# EAGLE design myc2000 (EAGLE 6.6.0)
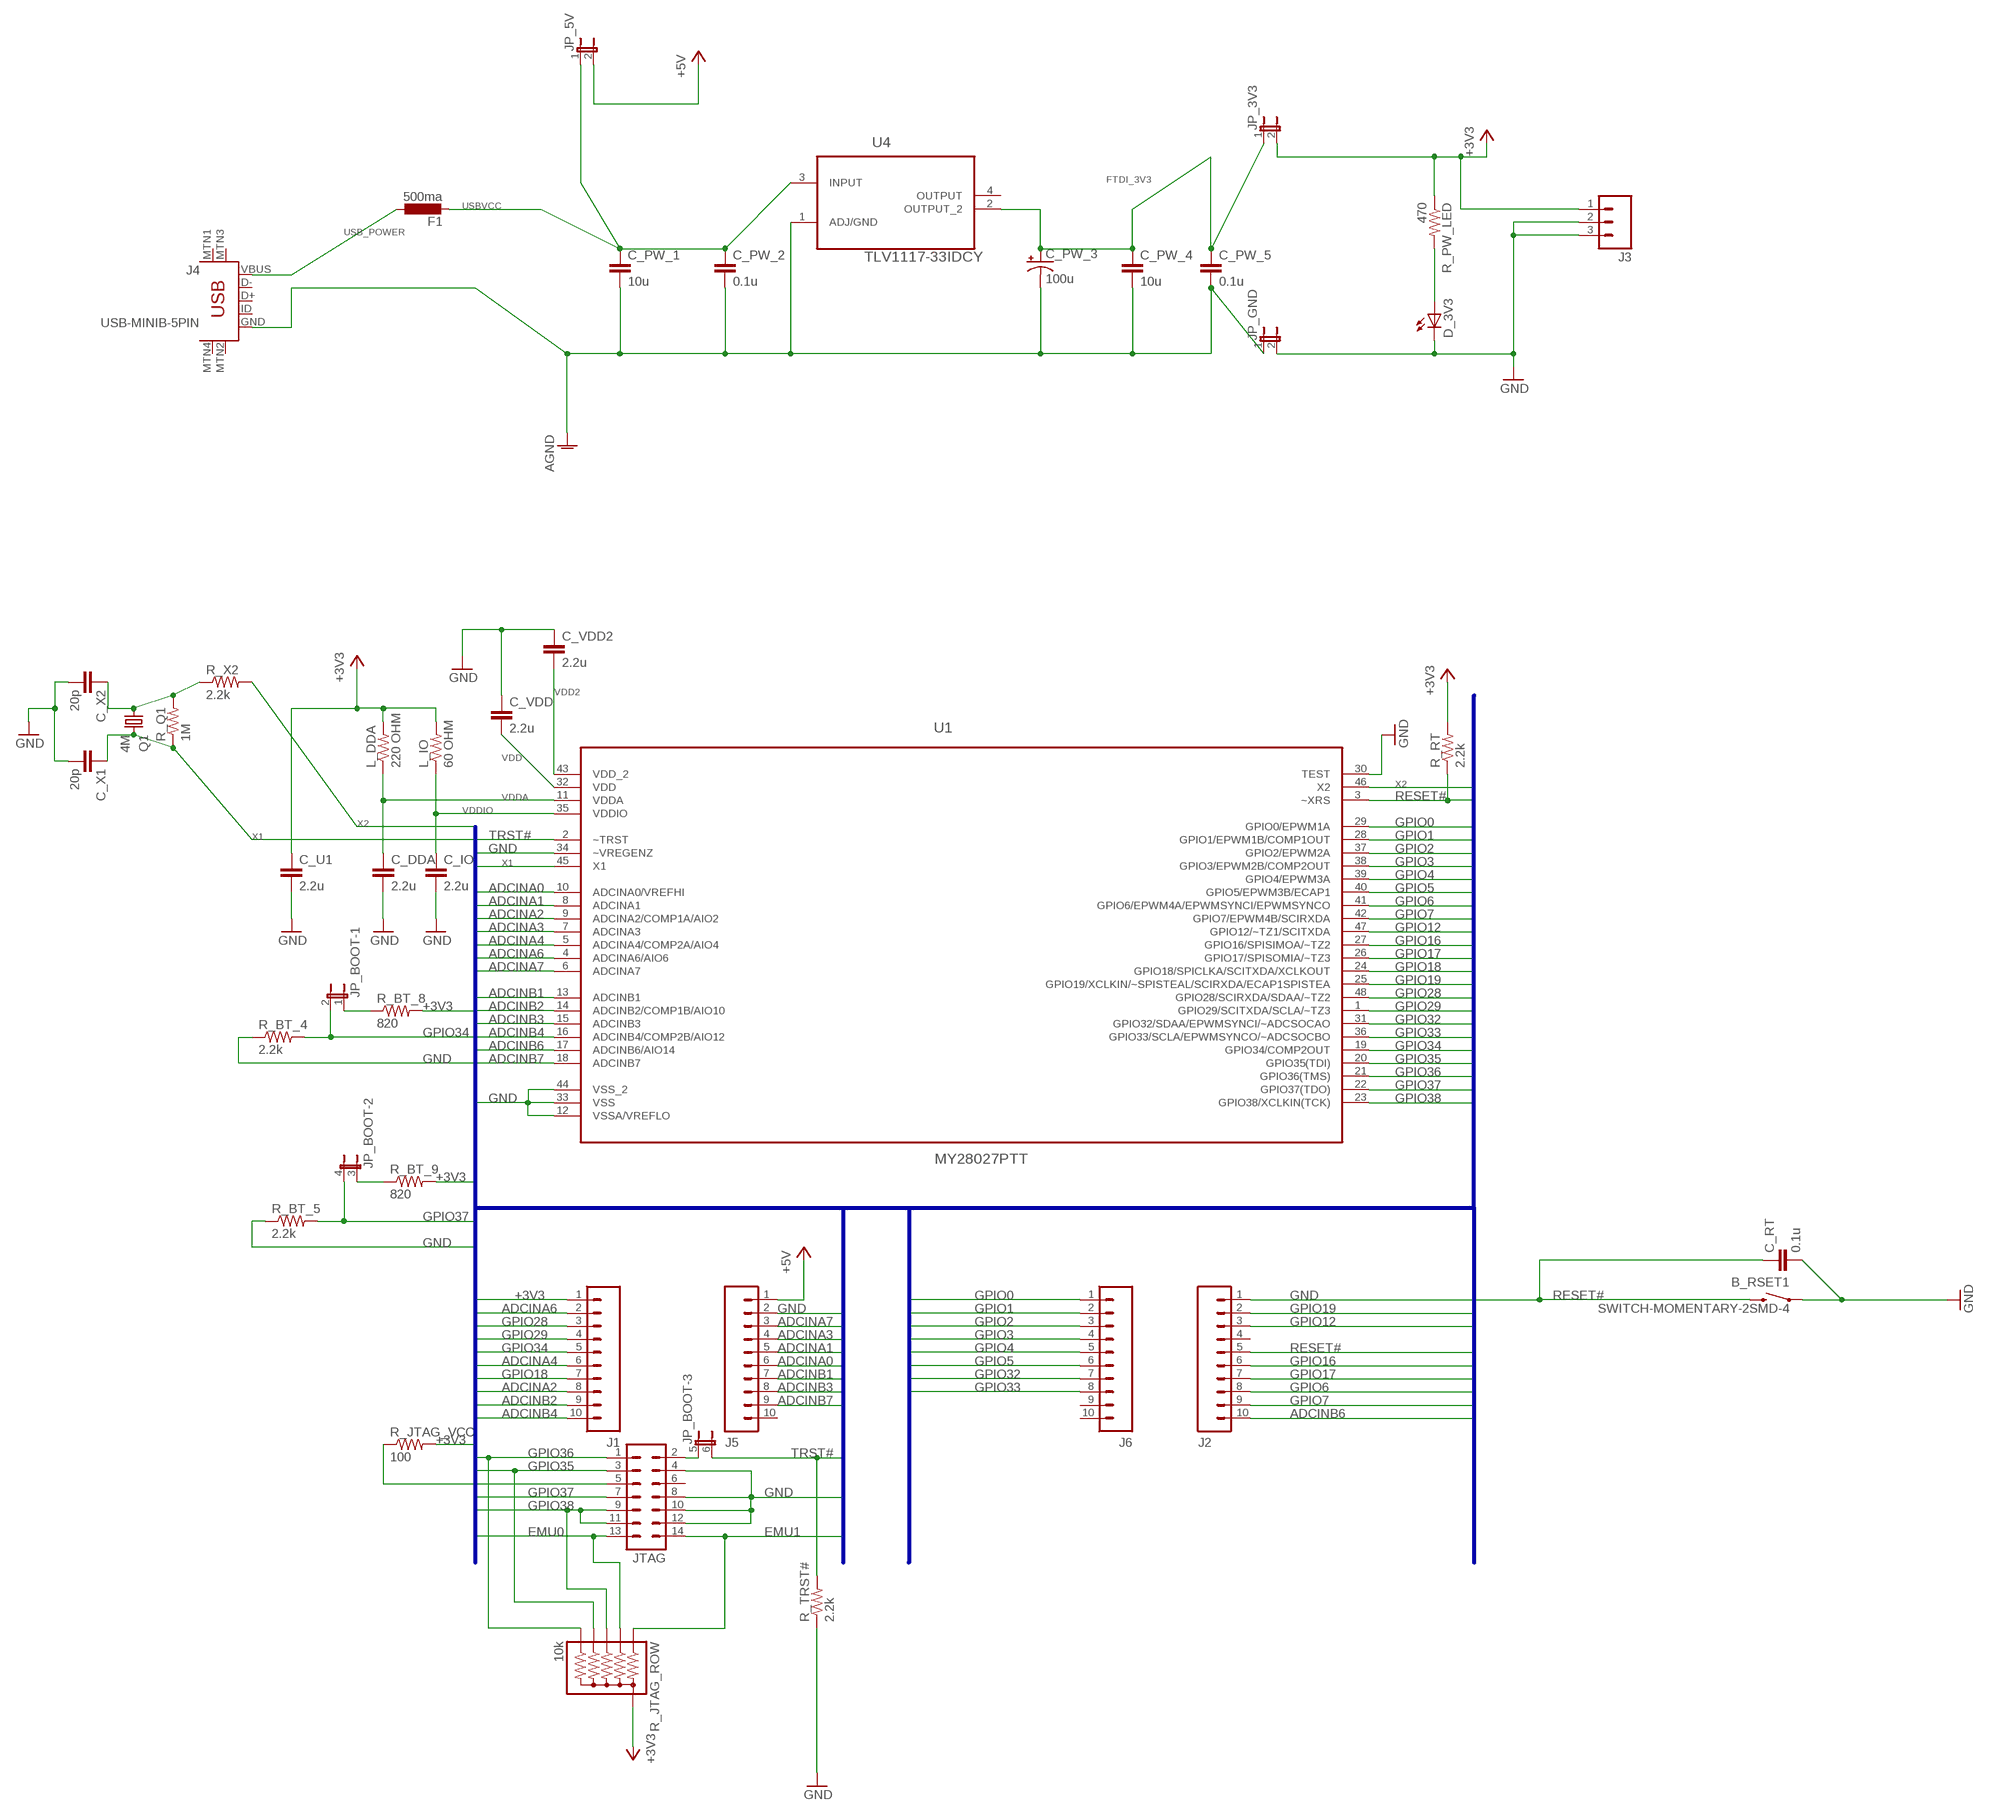
[diagram p0: schematic, sheet 1]

## Parts
B_RSET1  SWITCH-MOMENTARY-2SMD-4  [TACTILE_SWITCH_TALL]
C_DDA  2.2u  CAP0805  [0805]
C_IO  2.2u  CAP0805  [0805]
C_PW_1  10u  CAP0805  [0805]
C_PW_2  0.1u  CAP0805  [0805]
C_PW_3  100u  CAP_POL3528  [EIA3528]
C_PW_4  10u  CAP0805  [0805]
C_PW_5  0.1u  CAP0805  [0805]
C_RT  0.1u  CAP0805  [0805]
C_U1  2.2u  CAP0805  [0805]
C_VDD  2.2u  CAP0805  [0805]
C_VDD2  2.2u  CAP0805  [0805]
C_X1  20p  CAP0603-CAP  [0603-CAP]
C_X2  20p  CAP0603-CAP  [0603-CAP]
D_3V3  LEDSML0805  [SML0805]
F1  500ma  L-EUL1812  [L1812]
J1  M10NO_SILK_PTH_FEMALE  [1X10_NO_SILK]
J2  M10NO_SILK_PTH_FEMALE  [1X10_NO_SILK]
J3  M031X03_NO_SILK  [1X03_NO_SILK]
J4  USB-MINIB-5PIN  [USB-MINIB]
J5  M10NO_SILK_PTH_FEMALE  [1X10_NO_SILK]
J6  M10NO_SILK_PTH_FEMALE  [1X10_NO_SILK]
JP_3V3  JP1E  [JP1]
JP_5V  JP1E  [JP1]
JP_BOOT  JP3QE  [JP3Q]
JP_GND  JP1E  [JP1]
JTAG  MA07-2  [MA07-2]
L_DDA  220 OHM  RESISTOR0603  [0603-RES]
L_IO  60 OHM  RESISTOR0805-RES  [0805]
Q1  4M  CRYSTALHC49UP  [HC49UP]
R_BT_4  2.2k  RESISTOR0805-RES  [0805]
R_BT_5  2.2k  RESISTOR0805-RES  [0805]
R_BT_8  820  RESISTOR0805-RES  [0805]
R_BT_9  820  RESISTOR0805-RES  [0805]
R_JTAG_ROW  10k  RPACK-BUSSED-5-SIP-PTH-5  [RPACK-SIP-PTH-5]
R_JTAG_VCC  100  RESISTOR0805-RES  [0805]
R_PW_LED  470  RESISTOR0805-RES  [0805]
R_Q1  1M  RESISTOR0603  [0603-RES]
R_RT  2.2k  RESISTOR0805-RES  [0805]
R_TRST#  2.2k  RESISTOR0805-RES  [0805]
R_X2  2.2k  RESISTOR0603  [0603-RES]
U1  MY28027PTT  [QFP50P900X900X160-48N]
U4  TLV1117-33IDCY  [SOT230P700X180-4N]

## Nets
+3V3 [POWER]: C_U1.1 J1.1 J3.1 JP_3V3.2 L_DDA.2 L_IO.2 R_BT_8.2 R_BT_9.2 R_JTAG_ROW.P$1 R_JTAG_VCC.2 R_PW_LED.1 R_RT.2
+5V [P5V]: J5.1 JP_5V.2
ADCINA0: J5.6 U1.10(ADCINA0/VREFHI)
ADCINA1: J5.5 U1.8(ADCINA1)
ADCINA2: J1.8 U1.9(ADCINA2/COMP1A/AIO2)
ADCINA3: J5.4 U1.7(ADCINA3)
ADCINA4: J1.6 U1.5(ADCINA4/COMP2A/AIO4)
ADCINA6: J1.2 U1.4(ADCINA6/AIO6)
ADCINA7: J5.3 U1.6(ADCINA7)
ADCINB1: J5.7 U1.13(ADCINB1)
ADCINB2: J1.9 U1.14(ADCINB2/COMP1B/AIO10)
ADCINB3: J5.8 U1.15(ADCINB3)
ADCINB4: J1.10 U1.16(ADCINB4/COMP2B/AIO12)
ADCINB6: J2.10 U1.17(ADCINB6/AIO14)
ADCINB7: J5.9 U1.18(ADCINB7)
AGND [P5V]: C_PW_1.2 C_PW_2.2 C_PW_3.C(-) C_PW_4.2 C_PW_5.2 J4.GND JP_GND.1 U4.1(ADJ/GND)
EMU0: JTAG.13 R_JTAG_ROW.P$3
EMU1: JTAG.14 R_JTAG_ROW.P$2
FTDI_3V3 [P5V]: C_PW_3.A(+) C_PW_4.1 C_PW_5.1 JP_3V3.1 U4.2(OUTPUT_2)
GND [POWER]: B_RSET1.A2 C_DDA.2 C_IO.2 C_RT.2 C_U1.2 C_VDD2.1 C_VDD.1 C_X1.2 C_X2.2 D_3V3.C J2.1 J3.2 J3.3 J5.2 JP_GND.2 JTAG.4 JTAG.8 JTAG.10 JTAG.12 R_BT_4.1 R_BT_5.1 R_TRST#.1 U1.12(VSSA/VREFLO) U1.30(TEST) U1.33(VSS) U1.34(~VREGENZ) U1.44(VSS_2)
GPIO0: J6.1 U1.29(GPIO0/EPWM1A)
GPIO1: J6.2 U1.28(GPIO1/EPWM1B/COMP1OUT)
GPIO2: J6.3 U1.37(GPIO2/EPWM2A)
GPIO3: J6.4 U1.38(GPIO3/EPWM2B/COMP2OUT)
GPIO4: J6.5 U1.39(GPIO4/EPWM3A)
GPIO5: J6.6 U1.40(GPIO5/EPWM3B/ECAP1)
GPIO6: J2.8 U1.41(GPIO6/EPWM4A/EPWMSYNCI/EPWMSYNCO)
GPIO7: J2.9 U1.42(GPIO7/EPWM4B/SCIRXDA)
GPIO12: J2.3 U1.47(GPIO12/~TZ1/SCITXDA)
GPIO16: J2.6 U1.27(GPIO16/SPISIMOA/~TZ2)
GPIO17: J2.7 U1.26(GPIO17/SPISOMIA/~TZ3)
GPIO18: J1.7 U1.24(GPIO18/SPICLKA/SCITXDA/XCLKOUT)
GPIO19: J2.2 U1.25(GPIO19/XCLKIN/~SPISTEAL/SCIRXDA/ECAP1SPISTEA)
GPIO28 [SCI]: J1.3 U1.48(GPIO28/SCIRXDA/SDAA/~TZ2)
GPIO29 [SCI]: J1.4 U1.1(GPIO29/SCITXDA/SCLA/~TZ3)
GPIO32: J6.7 U1.31(GPIO32/SDAA/EPWMSYNCI/~ADCSOCAO)
GPIO33: J6.8 U1.36(GPIO33/SCLA/EPWMSYNCO/~ADCSOCBO)
GPIO34: J1.5 JP_BOOT.2 R_BT_4.2 U1.19(GPIO34/COMP2OUT)
GPIO35 [JTAG]: JTAG.3 R_JTAG_ROW.P$5 U1.20(GPIO35(TDI))
GPIO36 [JTAG]: JTAG.1 R_JTAG_ROW.P$6 U1.21(GPIO36(TMS))
GPIO37 [JTAG]: JP_BOOT.4 JTAG.7 R_BT_5.2 U1.22(GPIO37(TDO))
GPIO38 [JTAG]: JTAG.9 JTAG.11 R_JTAG_ROW.P$4 U1.23(GPIO38/XCLKIN(TCK))
JTAG_TRST: JP_BOOT.5 JTAG.2
N$1: D_3V3.A R_PW_LED.2
N$11: JP_BOOT.3 R_BT_9.1
N$12: JP_BOOT.1 R_BT_8.1
N$13: JTAG.5 R_JTAG_VCC.1
RESET# [CLOCK]: B_RSET1.B2 C_RT.1 J2.5 R_RT.1 U1.3(~XRS)
TRST#: JP_BOOT.6 R_TRST#.2 U1.2(~TRST)
USB_POWER [P5V]: F1.1 J4.VBUS
USBVCC [P5V]: C_PW_1.1 C_PW_2.1 F1.2 JP_5V.1 U4.3(INPUT)
VDD [P4CORE]: C_VDD.2 U1.32(VDD)
VDD2 [P4CORE]: C_VDD2.2 U1.43(VDD_2)
VDDA [POWER]: C_DDA.1 L_DDA.1 U1.11(VDDA)
VDDIO [POWER]: C_IO.1 L_IO.1 U1.35(VDDIO)
X1 [CLOCK]: C_X1.1 Q1.2 R_Q1.1 U1.45(X1)
X2 [CLOCK]: R_X2.2 U1.46(X2)
X2_2 [CLOCK]: C_X2.1 Q1.1 R_Q1.2 R_X2.1
Unconnected: J2.4 J4.D+ J4.D- J4.ID J4.MTN1(MTN2) J4.MTN2(MTN3) J4.MTN3(MTN1) J4.MTN4 J5.10 J6.9 J6.10 JTAG.6 U4.4(OUTPUT)

## Buses
GPIO[0..38],ADCINA[0..7],ADCINB[0..7],GND,TRST#,RESET#,+3V3,EMU0,EMU1,X1,X2

## Library data of the parts
B_RSET1 = SparkFun-Electromechanical:SWITCH-MOMENTARY-2: Various NO switches- pushbuttons, reed, etc; PROD_ID: SWCH-11966
C_DDA C_IO C_PW_1 C_PW_2 C_PW_4 C_PW_5 C_RT C_U1 C_VDD C_VDD2 C_X1 C_X2 = SparkFun-Capacitors:CAP: Capacitor Standard 0603 ceramic capacitor, and 0.1" leaded capacitor.
C_PW_3 = SparkFun-Capacitors:CAP_POL: Capacitor Polarized These are standard SMD and PTH capacitors. Normally 10uF, 47uF, and 100uF in electrolytic and tantalum varieties. Always verify the external diameter of the through hole cap, it varies with capacity, voltage, and manufacturer. The EIA devices should be standard.
D_3V3 = led:LED: LED OSRAM: - CHIPLED LG R971, LG N971, LY N971, LG Q971, LY Q971, LO R971, LY R971 LH N974, LH R974 LS Q976, LO Q976, LY Q976 LO Q996 - Hyper CHIPLED LW Q18S LB Q993, LB Q99A, LB R99A - SideLED LS A670, LO A670, LY A670, LG A670, LP A670 LB A673, LV A673, LT A673, LW A673 LH A674 LY A675 LS A676, LA A676, LO A676, LY A676, LW A676 LS A679, LY A679, LG A679 - Hyper Micro SIDELED® LS Y876, LA Y876, LO Y876, LY Y876 LT Y87S - SmartLED LW L88C, LW L88S LB L89C, LB L89S, LG L890 LS L89K, LO L89K, LY L89K LS L896, LA L896, LO L896, LY L896 - TOPLED LS T670, LO T670, LY T670, LG T670, LP T670 LSG T670, LSP T670, LSY T670, LOP T670, LYG T670 LG T671, LOG T671, LSG T671 LB T673, LV T673, LT T673, LW T673 LH T674 LS T676, LA T676, LO T676, LY T676, LB T676, LH T676, LSB T676, LW T676 LB T67C, LV T67C, LT T67C, LS T67K, LO T67K, LY T67K, LW E67C LS E67B, LA E67B, LO E67B, LY E67B, LB E67C, LV E67C, LT E67C LW T67C LS T679, LY T679, LG T679 LS T770, LO T770, LY T770, LG T770, LP T770 LB T773, LV T773, LT T773, LW T773 LH T774 LS E675, LA E675, LY E675, LS T675 LS T776, LA T776, LO T776, LY T776, LB T776 LHGB T686 LT T68C, LB T68C - Hyper Mini TOPLED® LB M676 - Mini TOPLED Santana® LG M470 LS M47K, LO M47K, LY M47K Source: http://www.osram.convergy.de LUXEON: - LUMILED® LXK2-PW12-R00, LXK2-PW12-S00, LXK2-PW14-U00, LXK2-PW14-V00 LXK2-PM12-R00, LXK2-PM12-S00, LXK2-PM14-U00 LXK2-PE12-Q00, LXK2-PE12-R00, LXK2-PE12-S00, LXK2-PE14-T00, LXK2-PE14-U00 LXK2-PB12-K00, LXK2-PB12-L00, LXK2-PB12-M00, LXK2-PB14-N00, LXK2-PB14-P00, LXK2-PB14-Q00 LXK2-PR12-L00, LXK2-PR12-M00, LXK2-PR14-Q00, LXK2-PR14-R00 LXK2-PD12-Q00, LXK2-PD12-R00, LXK2-PD12-S00 LXK2-PH12-R00, LXK2-PH12-S00 LXK2-PL12-P00, LXK2-PL12-Q00, LXK2-PL12-R00 Source: www.luxeon.com KINGBRIGHT: KA-3528ASYC Source: www.kingbright.com
F1 = rcl:L-EU: INDUCTOR, European symbol
J1 J2 J5 J6 = SparkFun-Connectors:M10: Header 10 Standard 10-pin 0.1" header. Use with straight break away headers (SKU : PRT-00116), right angle break away headers (PRT-00553), swiss pins (PRT-00743), machine pins (PRT-00117), and female headers (PRT-00115).; PROD_ID: CONN-11563
J3 = SparkFun-Connectors:M03: Header 3 Standard 3-pin 0.1" header. Use with straight break away headers (SKU : PRT-00116), right angle break away headers (PRT-00553), swiss pins (PRT-00743), machine pins (PRT-00117), and female headers (PRT-00115). Molex polarized connector foot print use with SKU : PRT-08232 with associated crimp pins and housings.
J4 = SparkFun-Connectors:USB-MINIB: Mini-USB "B" connector with 5th pin broken out. Created new symbol breaking out 5th "ID" pin in mini/micro USB connector spec. See: http://en.wikipedia.org/wiki/Mini_usb#Cables. Uses same footprint as 4-pin symbol. Also added pins to connect to mounting / shield pads if required (probably not generally needed as signals aren't shielded once they leave the connector).; PROD_ID: CONN-08193
JP_3V3 JP_5V JP_GND = jumper:JP1E: JUMPER
JP_BOOT = jumper:JP3QE: JUMPER
JTAG = con-lstb:MA07-2: PIN HEADER; OC_FARNELL: unknown; OC_NEWARK: unknown
L_DDA L_IO R_BT_4 R_BT_5 R_BT_8 R_BT_9 R_JTAG_VCC R_PW_LED R_Q1 R_RT R_TRST# R_X2 = SparkFun-Resistors:RESISTOR: Resistor Basic schematic elements and footprints for 0603, 1206, and PTH resistors.
Q1 = crystal:CRYSTAL: CRYSTAL; OC_FARNELL: unknown; OC_NEWARK: unknown
R_JTAG_ROW = SparkFun-Resistors:RPACK-BUSSED-5: BOURNS 4600X series thick-film SIP resistor packs Five resistors bussed to a single pin (denoted by dot). 0.2W / resistor datasheet <http://dlnmh9ip6v2uc.cloudfront.net/datasheets/Components/General/4600x.pdf> SFE parts COM-10855 (330), COM-10856 (10K)
U1 = Texas Instruments_By_element14_Batch_1:MY28027PTT
U4 = Texas Instruments_By_element14_Batch_1:TLV1117-33IDCY: V REG, LDO, 3.3V, 0.8A; MPN: TLV1117-33IDCY; OC_FARNELL: 1703385; OC_NEWARK: 67K8522; PACKAGE: SOT-223-3; SUPPLIER: TEXAS INSTRUMENTS

## Net classes
0 default: width 0.127 mm, drill 0.127 mm, clearance 0.127 mm
1 POWER: width 0.254 mm, drill 0.127 mm, clearance 0.127 mm to class 0, clearance 0.127 mm
2 CLOCK: width 0.127 mm, drill 0.127 mm, clearance 0.127 mm to class 0, clearance 0.127 mm to class 1, clearance 0.127 mm
3 P4CORE: width 0.203 mm, drill 0.127 mm, clearance 0.127 mm to class 0, clearance 0.127 mm to class 1, clearance 0.127 mm to class 2, clearance 0.127 mm
4 P5V: width 0.508 mm, drill 0.127 mm, clearance 0.127 mm to class 0, clearance 0.127 mm to class 1, clearance 0.127 mm to class 2, clearance 0.127 mm to class 3, clearance 0.127 mm
5 JTAG: width 0.127 mm, drill 0.127 mm, clearance 0.127 mm to class 0, clearance 0.127 mm to class 1, clearance 0.127 mm to class 2, clearance 0.127 mm to class 3, clearance 0.127 mm to class 4, clearance 0.127 mm
6 SCI: width 0.127 mm, drill 0.127 mm, clearance 0.127 mm to class 0, clearance 0.127 mm to class 1, clearance 0.127 mm to class 2, clearance 0.127 mm to class 3, clearance 0.127 mm to class 4, clearance 0.127 mm to class 5, clearance 0.127 mm

## Board
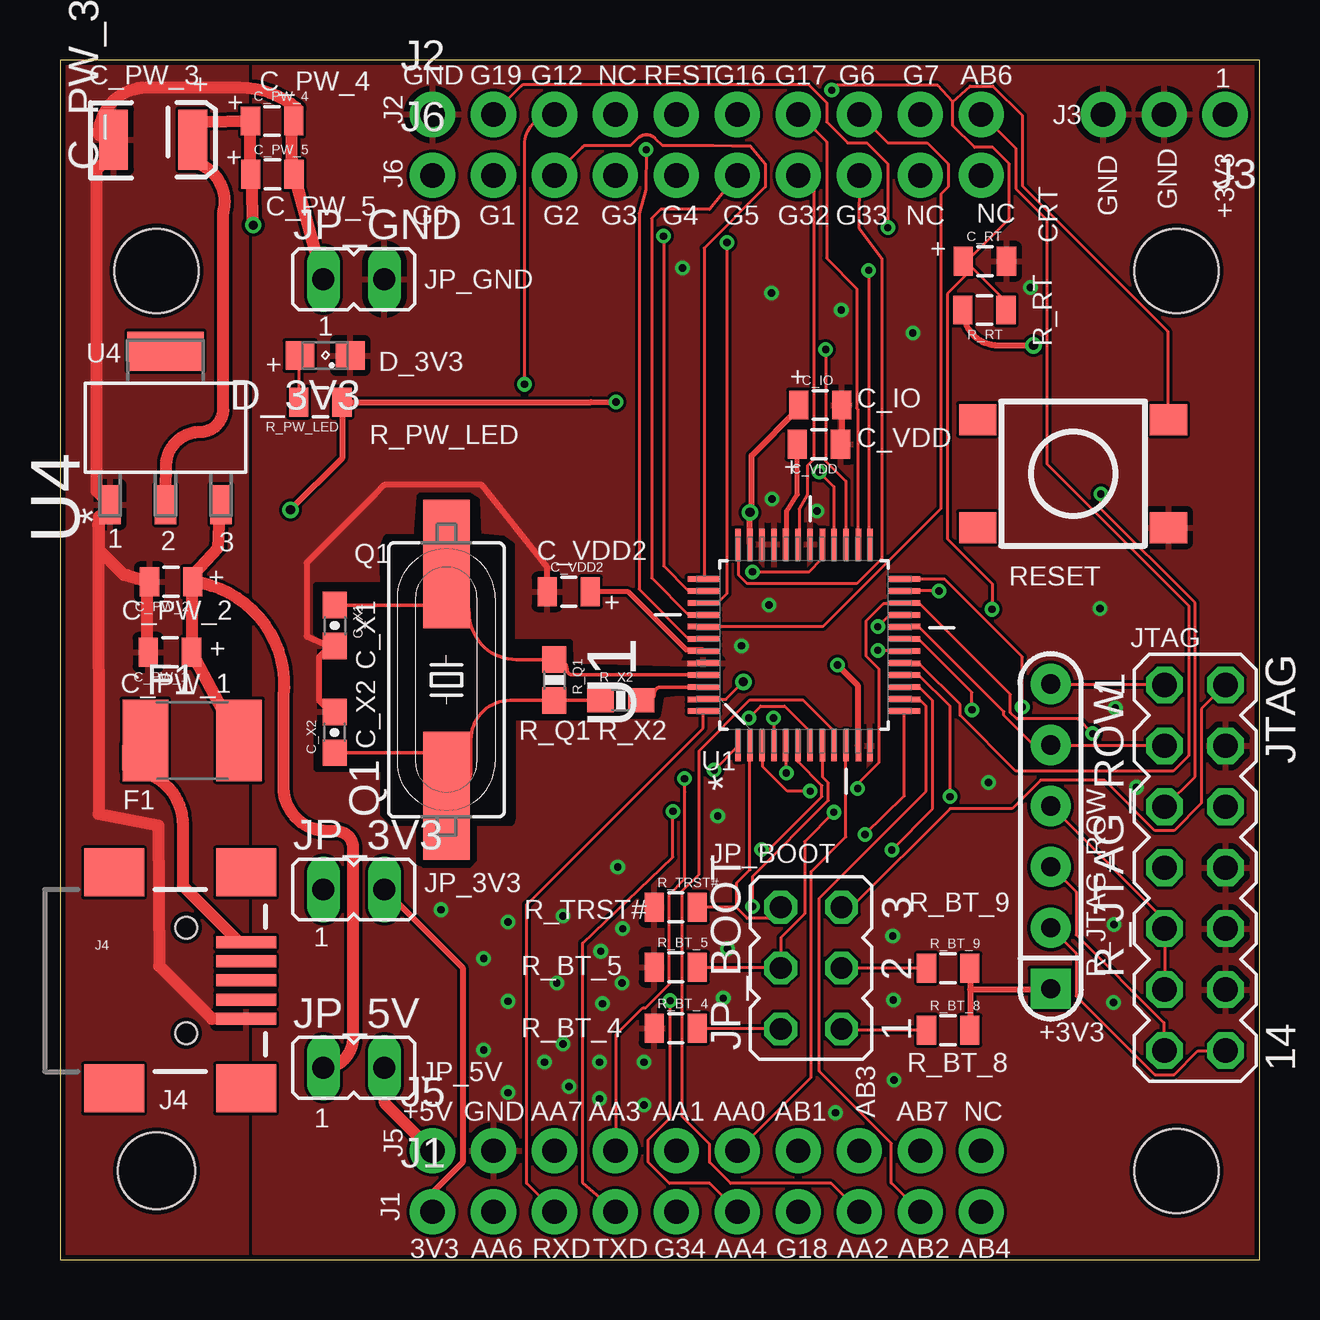
[diagram p1: board, top side]
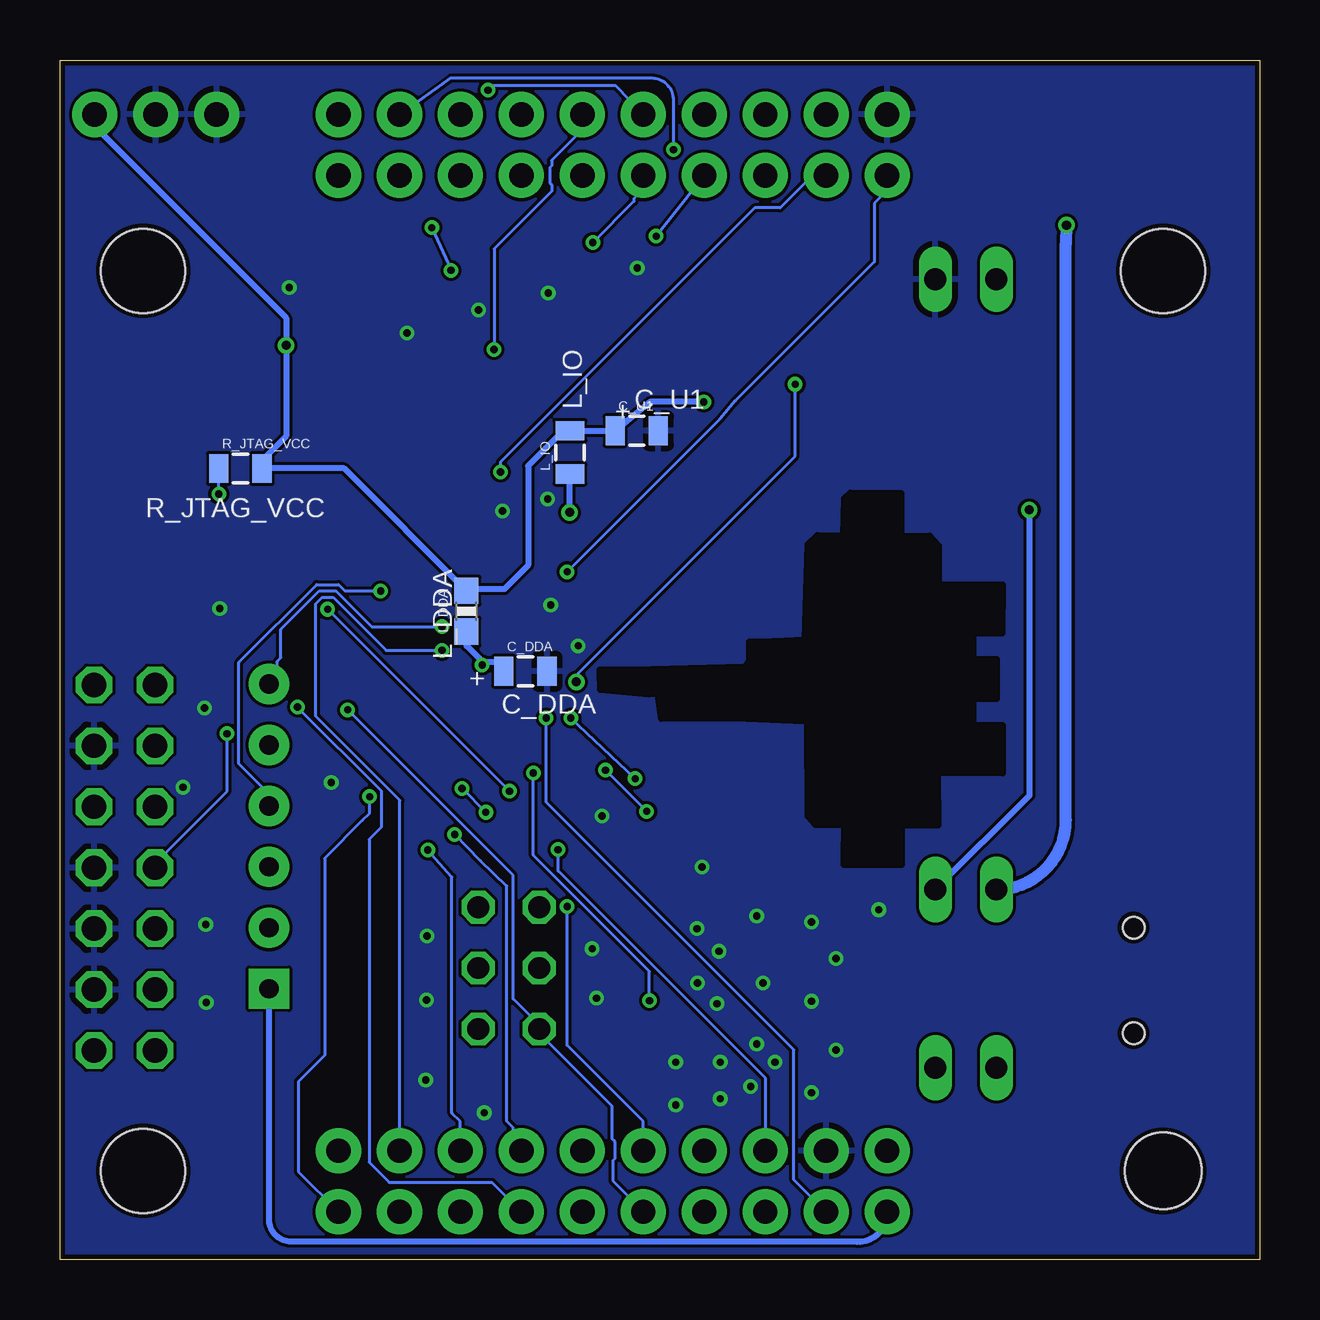
[diagram p2: board, bottom side, seen from below]

Size 49.99 x 49.99 mm. Coordinates in mm from the lower left corner, seen from the top.
Outline: 0,0 49.99,0 49.99,49.99 0,49.99 0,0
Copper layers (1*16): Top 0.035mm / dielectric 1.5mm / Bottom 0.035mm
Design rules "myc2000_drc": minimum track width 5mil, minimum drill 0.3mm, track to track 5mil, track to pad 6mil, pad to pad 6mil, via to via 5mil, smd to smd 6mil, copper to edge 8mil, drill to drill 6mil, minimum pad ring 6mil, minimum via ring 6mil, stop-mask expansion 4mil, vias tented up to drill 25mil, thermal gap 10mil
Holes 3.5 mm at 4.02,41.2 46.52,41.2 46.52,3.7
Holes 3.2 mm at 4.02,3.7
tRestrict: area 10.7,16.5 to 27.5,31.8
bRestrict: area 10.7,16.5 to 27.5,32

### Footprints (pad centres in the part's own frame; a part is rotated, then mirrored left to right if it is on the bottom)
TACTILE_SWITCH_TALL = smd 1.55 x 1.3: A1 -3.975,-2.25; A2 3.975,-2.25; B1 -3.975,2.25; B2 3.975,2.25
0805 = smd 0.8 x 1.2: 1 -0.9,0; 2 0.9,0
EIA3528 = smd 1.2 x 2.5: A 1.65,0; C -1.65,0
0603-CAP = smd 1.1 x 1: 1 -0.85,0; 2 0.85,0
SML0805 = smd 1.2 x 1.2: A 1.05,0; C -1.05,0
L1812 = smd 1.9 x 3.4: 1 -1.95,0; 2 1.95,0
1X10_NO_SILK = drill 1.016 pad 1.88: 1 0,0; 2 2.54,0; 3 5.08,0; 4 7.62,0; 5 10.16,0; 6 12.7,0; 7 15.24,0; 8 17.78,0; 9 20.32,0; 10 22.86,0
1X03_NO_SILK = drill 1.016 pad 1.88: 1 0,0; 2 2.54,0; 3 5.08,0
USB-MINIB = smd 2.5 x 0.5: D+ 2.5,0; D- 2.5,0.8; GND 2.5,-1.6; ID 2.5,-0.8; VBUS 2.5,1.6 | smd 2.5 x 2: MTN1 -3,4.5; MTN2 2.5,4.5; MTN3 -3,-4.5; MTN4 2.5,-4.5 | hole 0.9: 0,2.2; 0,-2.2
JP1 = drill 0.914 long: 1 0,-1.27; 2 0,1.27
JP3Q = drill 0.914 octagon: 1 -2.54,-1.27; 2 -2.54,1.27; 3 0,-1.27; 4 0,1.27; 5 2.54,-1.27; 6 2.54,1.27
MA07-2 = drill 1.016 octagon: 1 -7.62,-1.27; 2 -7.62,1.27; 3 -5.08,-1.27; 4 -5.08,1.27; 5 -2.54,-1.27; 6 -2.54,1.27; 7 0,-1.27; 8 0,1.27; 9 2.54,-1.27; 10 2.54,1.27; 11 5.08,-1.27; 12 5.08,1.27; 13 7.62,-1.27; 14 7.62,1.27
0603-RES = smd 1.1 x 1: 1 -0.85,0; 2 0.85,0
HC49UP = smd 5.334 x 1.93: 1 -4.826,0; 2 4.826,0
RPACK-SIP-PTH-5 = drill 0.8 pad 1.676 square: P$1 0,0 | drill 0.8 pad 1.676: P$2 0,-2.54; P$3 0,-5.08; P$4 0,-7.62; P$5 0,-10.16; P$6 0,-12.7
QFP50P900X900X160-48N = smd 1.321 x 0.229: 1 -4.191,2.743; 2 -4.191,2.261; 3 -4.191,1.753; 4 -4.191,1.245; 5 -4.191,0.762; 6 -4.191,0.254; 7 -4.191,-0.254; 8 -4.191,-0.762; 9 -4.191,-1.245; 10 -4.191,-1.753; 11 -4.191,-2.261; 12 -4.191,-2.743; 25 4.191,-2.743; 26 4.191,-2.261; 27 4.191,-1.753; 28 4.191,-1.245; 29 4.191,-0.762; 30 4.191,-0.254; 31 4.191,0.254; 32 4.191,0.762; 33 4.191,1.245; 34 4.191,1.753; 35 4.191,2.261; 36 4.191,2.743 | smd 0.229 x 1.321: 13 -2.743,-4.191; 14 -2.261,-4.191; 15 -1.753,-4.191; 16 -1.245,-4.191; 17 -0.762,-4.191; 18 -0.254,-4.191; 19 0.254,-4.191; 20 0.762,-4.191; 21 1.245,-4.191; 22 1.753,-4.191; 23 2.261,-4.191; 24 2.743,-4.191; 37 2.743,4.191; 38 2.261,4.191; 39 1.753,4.191; 40 1.245,4.191; 41 0.762,4.191; 42 0.254,4.191; 43 -0.254,4.191; 44 -0.762,4.191; 45 -1.245,4.191; 46 -1.753,4.191; 47 -2.261,4.191; 48 -2.743,4.191
SOT230P700X180-4N = smd 1.626 x 0.889: 1 -3.2,2.311; 2 -3.2,0; 3 -3.2,-2.311 | smd 1.626 x 3.175: 4 3.2,0

### Placement (x,y rotation side)
B_RSET1  42.21,32.75 0 top
C_DDA  30.6,24.52 0 bottom
C_IO  31.68,35.61 0 top
C_PW_1  4.58,25.31 180 top
C_PW_2  4.63,28.24 180 top
C_PW_3  3.88,46.67 0 top
C_PW_4  8.83,47.45 0 top
C_PW_5  8.85,45.22 0 top
C_RT  38.54,41.61 0 top
C_U1  25.96,34.54 0 bottom
C_VDD  31.62,33.98 180 top
C_VDD2  21.2,27.83 0 top
C_X1  11.45,26.42 270 top
C_X2  11.44,21.97 90 top
D_3V3  11.05,37.67 180 top
F1  5.51,21.64 0 top
J1  15.52,2 0 top
J2  15.52,47.72 0 top
J3  48.54,47.72 180 top
J4  5.26,11.63 0 top
J5  15.52,4.54 0 top
J6  15.52,45.18 0 top
JP_3V3  12.24,15.43 270 top
JP_5V  12.24,8 270 top
JP_BOOT  31.29,12.15 90 top
JP_GND  12.24,40.85 270 top
JTAG  47.29,16.33 270 top
L_DDA  33.05,27.02 90 bottom
L_IO  28.74,33.64 90 bottom
Q1  16.1,24.16 90 top
R_BT_4  25.66,9.64 0 top
R_BT_5  25.66,12.19 0 top
R_BT_8  37.01,9.56 0 top
R_BT_9  37.01,12.15 0 top
R_JTAG_ROW  41.28,11.29 180 top
R_JTAG_VCC  42.47,32.97 0 bottom
R_PW_LED  10.85,35.73 180 top
R_Q1  20.6,24.15 270 top
R_RT  38.52,39.57 180 top
R_TRST#  25.66,14.68 0 top
R_X2  23.37,23.31 0 top
U1  31,25.61 90 top
U4  4.39,34.66 90 top

### Tracks (layer width: path | path; a pad name or v marks a point on that pad's centre or on a via)
+3V3  (via drill 0.3, 0.38)
  Top 0.254: v9.6,31.24 11.75,33.39 R_PW_LED.1 22.12,35.73 v23.16,35.74 | R_RT.2 arc90 39.09,38.1 v40.56,38.1 | 37.92,11.25 37.92,12.13 R_BT_9.2 | 37.92,11.25 37.92,9.58 R_BT_8.2 37.96,9.46 | 37.92,11.25 41.27,11.25 R_JTAG_ROW.P$1 | J1.1 15.56,2.03 15.56,2.83 16.78,4.05 16.78,12.17 13.54,15.41 JP_3V3.2
  Bottom 0.254: v9.6,31.24 9.6,19.34 JP_3V3.2 | v23.16,35.74 25.4,35.74 C_U1.1 L_IO.2 29.01,34.54 30.48,33.07 30.48,28.93 31.47,27.94 32.99,27.94 L_DDA.2 38.15,32.97 R_JTAG_VCC.2 41.57,33.31 40.56,34.32 v40.56,38.1 40.56,39.24 48.54,47.22 J3.1 | R_JTAG_ROW.P$1 arc90 R_JTAG_ROW.P$1 41.27,1.7 arc-90 40.36,0.75 16.88,0.75 arc-90 15.55,1.78 15.52,1.78 J1.1
+5V
  Top 0.508: JP_5V.2 13.54,7.98 13.54,6.53 J5.1
ADCINA0
  Top 0.127: U1.10 32.74,21.39 32.74,17.62 31.29,16.17 31.29,7.59 28.24,4.55 J5.6
ADCINA1  (via drill 0.3)
  Top 0.127: v28.85,14.72 28.85,15.98 32.02,19.14 32.02,19.86 31.79,20.09 31.79,21.39 U1.8
  Bottom 0.127: v28.85,14.72 28.85,8.93 25.69,5.77 J5.5
ADCINA2
  Top 0.127: U1.9 32.24,22.03 30.95,23.33 28.74,23.33 26.63,21.2 26.63,16.05 25.92,15.37 25.92,5.96 27.06,4.81 27.06,4.05 27.94,3.18 32.13,3.18 33.27,2.03 J1.8
ADCINA3  (via drill 0.3)
  Top 0.127: v28.7,22.57 29.2,23.06 30.19,23.06 31.25,22 U1.7 | v26.02,20.04 26.02,19.67 26.03,19.48 26.03,15.86 25.39,15.21 25.39,11.48 24.4,10.49 24.28,10.49 23.18,9.39 23.18,4.55 J5.4
  Bottom 0.127: v26.02,20.04 v28.7,22.57
ADCINA4  (via drill 0.3)
  Top 0.127: v30.26,20.28 30.26,21.39 U1.5 | v25.43,10.8 25.43,5.92 24.51,5 24.51,4.05 25.39,3.18 27.06,3.18 28.21,2.03 J1.6
  Bottom 0.127: v30.26,20.28 30.26,16.85 25.43,12.01 v25.43,10.8
ADCINA6  (via drill 0.3)
  Top 0.127: v29.73,22.57 29.73,21.43 U1.4
  Bottom 0.127: v29.73,22.57 29.73,19.06 19.41,8.74 19.41,3.33 J1.2
ADCINA7  (via drill 0.3)
  Top 0.127: v29.24,17.08 29.54,17.08 31.75,19.29 31.75,19.75 30.76,20.74 30.76,21.39 U1.6
  Bottom 0.127: v29.24,17.08 29.24,16.21 20.59,7.56 20.59,4.55 J5.3
ADCINB1  (via drill 0.3)
  Top 0.127: v33.54,17.72 35.18,19.33 35.18,22.83 U1.13
  Bottom 0.127: v33.54,17.72 32.47,16.62 31.37,15.57 31.37,5.77 31.1,5.5 31.1,5.42 30.8,5.12 30.8,4.55 J5.7
ADCINB2
  Top 0.127: U1.14 35.22,23.33 35.83,23.33 36.09,23.06 36.09,19.52 31.64,15.06 31.64,7.86 34.65,4.85 34.65,3.18 34.66,3.18 J1.9
ADCINB3  (via drill 0.3)
  Top 0.127: v34.66,17.07 36.36,18.8 36.36,23.29 35.83,23.83 35.22,23.83 U1.15
  Bottom 0.127: v34.66,17.07 33.65,15.94 33.65,6.11 33.31,5.77 J5.8
ADCINB4  (via drill 0.3)
  Top 0.127: v37.08,19.29 37.08,23.06 35.79,24.36 35.22,24.36 U1.16
  Bottom 0.127: v37.08,19.29 37.08,18.61 37.39,18.3 38.96,16.73 38.96,8.51 40.06,7.42 40.06,4.19 40.06,3.67 J1.10
ADCINB6
  Top 0.127: U1.17 35.22,24.82 35.83,24.82 37.5,23.14 37.5,22.68 39.83,20.36 46.38,20.36 47.03,21.01 47.03,27.25 41.12,33.16 41.12,43.33 39.83,44.63 39.83,46.3 38.42,47.71 J2.10
ADCINB7  (via drill 0.3)
  Top 0.127: v34.07,25.39 35.18,25.39 U1.18
  Bottom 0.127: v34.07,25.39 36.4,25.39 38.61,27.6 39.06,27.6 39.33,27.33 39.33,22.64 35.83,19.14 35.83,4.55 J5.9
AGND
  Top 0.127: C_PW_5.2 9.75,45.22 9.75,45.15
  Top 0.508: C_PW_1.2 3.62,25.12 3.62,28.17 C_PW_2.2 2.78,28.52 2.67,28.52 1.63,29.57 1.63,30.96 1.93,31.17 U4.1 | C_PW_5.2 9.64,45.94 9.64,46.89 C_PW_4.2 9.73,47.97 9.88,47.97 arc40 7.48,48.84 3.61,48.84 arc90 1.62,46.86 C_PW_3.C 2.23,46.12 1.52,45.42 1.52,32.02 U4.1 | 2.08,31.42 U4.1 | U4.1 1.85,31.17 1.59,30.62 1.61,18.58 4.1,18.1 4.13,12.24 6.34,10.03 J4.GND | 9.75,45.15 10.95,40.86 JP_GND.1
  pour Top (isolate 0.127, rank 3): 0.23,49.76 7.82,49.76 7.82,0.23 0.23,0.23
EMU0
  Top 0.127: JTAG.13 46,8.74 46,9.88 42.34,13.54 42.34,15.33 41.31,16.36 R_JTAG_ROW.P$3
EMU1
  Top 0.127: JTAG.14 48.55,8.7 47.41,8.7 46.42,7.71 45.62,7.71 42.34,10.99 42.34,12.78 41.31,13.81 R_JTAG_ROW.P$2
FTDI_3V3  (via drill 0.38)
  Top 0.508: U4.2 4.42,32.97 arc-90 5.77,34.49 arc90 6.81,35.38 6.81,43.64 | 6.81,43.64 arc90 5.64,45.69 | 5.64,45.69 5.51,46.42 | 5.51,46.42 arc-90 C_PW_3.A | 6.81,43.64 arc90 5.64,45.69 | 5.51,46.42 5.77,47.19 arc-90 5.97,47.42 C_PW_4.1 7.92,47.7 7.92,45.48 C_PW_5.1 arc90 8.01,44.78 8.04,43.1 v8.05,43.1
  Bottom 0.508: v8.05,43.1 8.08,42.34 8.08,18.32 arc90 JP_3V3.1
GND  (via drill 0.3)
  Top 0.254: C_X2.2 11.42,22.87 11.23,22.87 10.78,23.32 10.78,25.1 11.23,25.54 11.42,25.54 C_X1.2 11.16,25.6 10.27,25.98 10.27,29.03 13.13,31.89 13.51,32.28 17.58,32.28 20.31,28.84 20.31,27.95 C_VDD2.1 | 12.34,37.66 D_3V3.C | 24.75,14.66 R_TRST#.1 | 24.75,12.24 R_BT_5.1 | C_VDD.1 32.56,33.99 32.56,35.57 C_IO.2
  other vias: 32.55,39.57 40.44,40.51 29.67,31.7 31.55,31.19 28.4,25.58 29.54,27.28 24.33,8.23 22.48,8.23 23.24,16.36 27.41,18.49 23.42,11.53 43.33,27.13 43.97,22.99 35.53,38.61 29.64,40.28 25.93,41.33 27.64,10.9 43.89,10.72 43.92,13.97 38.68,19.89 32.31,6.12 34.75,7.49 34.72,10.82 34.7,13.49 27.81,12.95 44.86,19.69 23.44,13.79 22.53,12.85 22.61,10.67 24.33,6.45 22.48,6.71 20.95,14.33 20.7,11.53 20.95,8.99 20.19,8.23 21.21,7.21 18.67,14.07 18.67,10.77 18.67,6.96 17.65,8.74 17.65,12.55 15.88,14.58
  pour Bottom (isolate 0.127): 0.23,49.76 49.76,49.76 49.76,0.23 0.23,0.23
  pour Top (isolate 0.127, rank 2): 8.08,49.76 49.76,49.76 49.76,0.23 8.08,0.23
GPIO0  (via drill 0.3)
  Top 0.127: v28.85,28.66 31.22,28.66 31.75,29.2 31.75,29.77 U1.29
  Bottom 0.127: v28.85,28.66 22.49,35.03 21.84,35.79 16.05,41.58 16.05,44.02 15.56,44.51 15.56,45.16 J6.1
GPIO1  (via drill 0.3)
  Top 0.127: v31.64,32.82 32.24,32.21 U1.28
  Bottom 0.127: v31.64,32.82 31.64,33.24 21.04,43.83 19.98,43.83 18.64,45.16 18.07,45.16 J6.2
GPIO2
  Top 0.127: U1.37 26.83,28.36 26.83,42.15 29.39,44.7 29.39,45.66 28.77,46.41 28,46.41 27.23,46.43 25.09,46.43 24.79,46.74 arc90 24.08,46.74 23.85,46.51 23.77,46.43 21.86,46.43 21.77,46.34 20.62,45.2 J6.3
GPIO3  (via drill 0.3)
  Top 0.127: v25.15,42.65 25.15,28.91 26.15,27.9 26.8,27.9 U1.38
  Bottom 0.127: v25.15,42.65 23.14,45.16 J6.4
GPIO4  (via drill 0.3)
  Top 0.127: v27.79,42.38 27.79,27.75 27.41,27.37 26.83,27.37 U1.39
  Bottom 0.127: v27.79,42.38 26.07,44.09 26.07,44.21 25.69,44.59 25.69,45.16 J6.5
GPIO5
  Top 0.127: U1.40 26.8,26.87 26.19,26.87 24.65,28.41 24.65,43.38 25.03,43.76 27.06,43.76 28.21,45.16 J6.6
GPIO6
  Top 0.127: U1.41 26.83,26.38 31.79,26.38 36.7,31.29 36.7,44.4 37.01,44.7 37.01,45.66 36.13,46.53 34.49,46.53 J2.8
GPIO7  (via drill 0.3)
  Top 0.127: v24.42,46.25 24.41,44.59 24.13,43.6 24.13,27.94 26.19,25.88 26.8,25.88 U1.42
  Bottom 0.127: J2.9 35.83,47.71 33.69,49.24 26.03,49.24 25.34,49.24 arc90 24.43,48.34 24.43,46.24 arc90 v24.42,46.25
GPIO12  (via drill 0.3, 0.38)
  Top 0.127: U1.47 27.74,23.35 v28.47,24.08 | v19.35,36.47 19.35,46.47 arc-90 J2.3
  Bottom 0.127: v28.47,24.08 28.47,24.36 19.35,33.48 v19.35,36.47
GPIO16  (via drill 0.3)
  Top 0.127: v31.9,37.92 31.9,33.27 32.74,32.44 32.74,29.81 U1.27
  Bottom 0.127: v31.9,37.92 31.9,42.11 29.5,44.51 29.5,44.78 29.58,44.86 29.58,45.5 29.5,45.58 29.5,45.81 28.24,47.07 28.24,47.71 J2.6
GPIO17
  Top 0.127: U1.26 33.24,29.81 33.24,35.45 33.2,35.48 33.2,40.46 31.94,41.73 31.94,46.57 30.8,47.71 J2.7
GPIO18  (via drill 0.3)
  Top 0.127: v40.09,23.03 40.09,25.12 36.86,28.36 35.22,28.36 U1.24
  Bottom 0.127: v40.09,23.03 36.59,19.52 36.59,18.03 37.11,17.51 37.11,4.06 36.27,3.23 32.51,3.23 31.99,3.23 J1.7
GPIO19  (via drill 0.3)
  Top 0.127: 33.71,29.86 U1.25 33.69,29.92 v33.69,41.22 | v34.49,43 34.49,45.66 33.62,46.53 32.82,46.53 31.94,47.41 31.94,48.21 31.18,48.97 20.1,48.97 19.29,48.97 19.23,48.91 18.07,47.75 J2.2
  Bottom 0.127: v34.49,43 v33.69,41.22
GPIO28
  Top 0.127: U1.48 26.8,22.83 26.8,22.15 19.44,14.8 19.44,3.18 20.59,2.03 J1.3
GPIO29  (via drill 0.3)
  Top 0.127: v27.25,20.4 28.24,21.39 U1.1 | v25.54,18.68 25.54,16.78 21.78,13.2 21.78,3.21 23.14,2.03 J1.4
  Bottom 0.127: v25.54,18.68 v27.25,20.4
GPIO32
  Top 0.127: 30.78,29.86 U1.31 30.8,29.92 30.8,31.28 31.14,31.88 31.14,33.08 31.41,33.35 31.41,44.55 30.8,45.16 J6.7
GPIO33
  Top 0.127: U1.36 28.28,29.77 28.28,28.51 28.63,28.17 33.2,28.17 34.24,29.21 34.24,41.73 33.29,43 33.31,45.16 J6.8
GPIO34  (via drill 0.3)
  Top 0.127: R_BT_4.2 26.57,9.61 30,9.61 JP_BOOT.2 | v38,22.91 38,23.64 35.79,25.84 35.22,25.84 U1.19
  Bottom 0.127: v38,22.91 31.1,16.01 31.1,10.87 30.04,9.8 30.04,9.61 JP_BOOT.2 30,9.58 30,9.42 26.99,6.41 26.99,5.04 26.87,4.93 26.87,4.2 26.95,4.13 26.95,3.29 25.69,2.03 J1.5
GPIO35
  Top 0.127: 35.23,26.37 U1.20 35.29,26.38 35.79,26.38 39.33,22.83 39.33,22.68 40.55,21.46 41.24,21.46 R_JTAG_ROW.P$5 | 41.33,21.41 R_JTAG_ROW.P$5 | JTAG.3 46,21.43 41.35,21.43 R_JTAG_ROW.P$5
GPIO36  (via drill 0.3)
  Top 0.127: v34.07,26.38 34.53,26.84 35.18,26.84 U1.21 | JTAG.1 46,23.98 41.31,23.98 R_JTAG_ROW.P$6
  Bottom 0.127: v34.07,26.38 37.01,26.38 38.49,27.86 39.18,27.86 40.78,26.26 40.78,25.08 40.93,24.93 40.93,24.36 41.27,24.02 R_JTAG_ROW.P$6
GPIO37  (via drill 0.3)
  Top 0.127: R_BT_5.2 26.57,12.17 30,12.17 JP_BOOT.4 30.04,12.21 30.04,13.42 31.03,14.41 31.03,17.42 v32.24,18.64 | v43.03,21.92 42.42,22.53 39.87,22.53 39.6,22.8 39.6,23.56 35.83,27.33 35.22,27.33 U1.22 35.14,27.33 34.3,27.33 33.58,26.61 33.58,25.16 34.11,24.63 34.11,20.7 33.24,19.82 v33.24,19.63
  Bottom 0.127: v43.03,21.92 43.03,19.52 46,16.55 46,16.36 JTAG.7 | v33.24,19.63 v32.24,18.64
GPIO38  (via drill 0.3)
  Top 0.127: JTAG.11 46.04,11.25 46.04,13.77 JTAG.9 46,13.84 46,14.19 41.31,18.87 R_JTAG_ROW.P$4 | v36.63,27.86 35.22,27.86 U1.23
  Bottom 0.127: v36.63,27.86 38.11,27.86 38.38,28.13 39.29,28.13 42.53,24.89 42.53,20.66 41.31,19.44 41.31,18.91 R_JTAG_ROW.P$4
JTAG_TRST
  Top 0.127: JTAG.2 47.56,22.95 47.56,19.02 46.42,17.88 45.62,17.88 43.52,19.98 40.86,19.98 39.67,18.8 37.08,18.8 33.01,14.72 32.59,14.72 JP_BOOT.5
N$1
  Top 0.127: 10.03,35.42 R_PW_LED.2 9.96,35.79 9.96,37.1 10.08,37.22 D_3V3.A
N$11
  Top 0.127: R_BT_9.1 36.09,12.17 32.59,12.17 JP_BOOT.3
N$12
  Top 0.127: R_BT_8.1 36.09,9.58 32.59,9.58 JP_BOOT.1
N$13  (via drill 0.3)
  Top 0.127: v43.37,31.9 43.37,31.29 47.29,27.37 47.29,20.13 46.04,18.87 JTAG.5
  Bottom 0.127: v43.37,31.9 R_JTAG_VCC.1
RESET#  (via drill 0.3)
  Top 0.127: 39.42,39.94 R_RT.1 39.37,39.98 37.77,41.58 37.66,41.58 C_RT.1 | v31.25,19.52 30.3,19.52 29.27,20.55 29.27,21.39 U1.3 | v38.84,27.1 38.84,28.17 36.97,30.04 36.97,40.25 38,41.28 C_RT.1 | 37.2,48.25 37.92,48.9 38.87,48.9 40.09,47.68 40.09,44.74 46.15,38.68 46.15,35.03 B_RSET1.B2 | 37.2,48.25 37.2,47.26 38.11,46.34 38.87,46.34 39.56,45.66 39.56,43.37 37.81,41.62 C_RT.1 | 37.2,48.25 36.56,48.93 32.36,48.93 v32.16,48.73
  Bottom 0.127: v38.84,27.1 v31.25,19.52 | 25.69,47.75 J2.5 26.85,48.93 31.95,48.93 v32.16,48.73
TRST#
  Top 0.127: 28.17,14.68 26.57,14.68 R_TRST#.2 | 28.17,14.68 28.63,14.22 29.54,14.22 30,14.68 JP_BOOT.6 | U1.2 28.74,21.39 28.74,16.24 28.21,15.71 28.21,14.72 28.17,14.68
USB_POWER
  Top 0.508: J4.VBUS 7.47,13.23 5.13,15.57 5.13,18.11 arc90 2.84,20.4 2.84,21.43 arc-90 F1.1
USBVCC
  Top 0.508: C_PW_1.1 5.5,25.2 5.5,28.25 C_PW_2.1 | U4.3 6.65,31.13 6.59,29.67 5.6,28.58 C_PW_2.1 | 5.37,24.97 C_PW_1.1 | C_PW_2.1 arc-90 9.32,23.44 9.32,19.69 arc90 11.15,17.86 11.51,17.86 arc-90 12.22,17.15 12.22,9.24 arc-90 JP_5V.1 | F1.2 C_PW_1.1
VDD
  Top 0.203: C_VDD.2 30.72,33.92 30.72,31.89 30.28,31.19 30.28,29.86 U1.32
VDD2
  Top 0.203: C_VDD2.2 22.15,27.83 23.67,27.83 26.09,25.41 26.78,25.41 U1.43
VDDA  (via drill 0.3)
  Top 0.254: v32.4,24.78 33.24,23.94 33.24,21.43 U1.11
  Bottom 0.254: 31.42,24.52 31.48,24.46 C_DDA.1 | 31.61,24.33 C_DDA.1 | 31.5,24.61 C_DDA.1 | 32.36,24.89 33.05,25.58 33.05,26.15 L_DDA.1 | 32.36,24.89 31.83,24.89 31.6,24.66 C_DDA.1 | v32.4,24.78 32.36,24.89
VDDIO  (via drill 0.38)
  Top 0.254: U1.35 28.74,31.14 v28.75,31.14 28.82,31.26 28.82,33.5 30.76,35.45 30.76,35.6 C_IO.1
  Bottom 0.254: v28.75,31.14 28.74,31.14 L_IO.1
X1
  Top 0.152: U1.45 21.35,24.37 arc-90 21.13,24.59 arc104 R_Q1.1 19.02,25 arc-90 17.04,26.98 arc152 16.13,27.2 | C_X1.1 16.06,27.27 arc-90 16.13,27.2 | 16.13,27.2 16.13,28.96 arc90 Q1.2
X2
  Top 0.152: U1.46 25.03,23.86 arc90 24.76,23.6 arc-125 R_X2.2
X2_2
  Top 0.152: R_X2.1 R_Q1.2 18.75,23.3 arc90 17.12,21.67 17.12,20.35 arc-90 Q1.1 arc-90 15.98,19.46 15.98,21.01 arc90 15.86,21.12 C_X2.1

### Text on the board
tPlace: C_PW_3 | C_PW_4 | GND | G19 | G12 | NC | REST | G16 | G17 | G6 | G7 | AB6 | 1 | + | + | J2 | J3 | GND | + | J6 | GND | C_PW_5 | G0 | G1 | G2 | G3 | G4 | G5 | G32 | G33 | NC | NC | +3V3 | + | CRT | JP_GND | 1 | R_RT | U4 | + | D_3V3 | + | C_IO | R_PW_LED | C_VDD | + | 1 | 2 | 3 | Q1 | C_VDD2 | RESET | + | + | C_PW_2 | JTAG | + | C_X1 | C_PW_1 | C_X2 | R_Q1 | R_X2 | U1 | F1 | JP_BOOT | JP_3V3 | R_TRST# | R_BT_9 | 1 | R_BT_5 | R_JTAG_ROW | +3V3 | R_BT_4 | R_BT_8 | JP_5V | J4 | +5V | GND | AA7 | AA3 | AA1 | AA0 | AB1 | AB3 | AB7 | NC | 1 | J5 | J1 | 3V3 | AA6 | RXD | TXD | G34 | AA4 | G18 | AA2 | AB2 | AB4
bPlace: C_U1 | + | L_IO | R_JTAG_VCC | L_DDA | + | C_DDA